# Altium schematic sheet 01-Revision_History_and_Contents.SchDoc: Revision History and Table of Contents
size A; Revision: A; SheetNumber: 1; SheetTotal: 4; ECE315_Project_Name: S25 Brushed DC Motor - Student
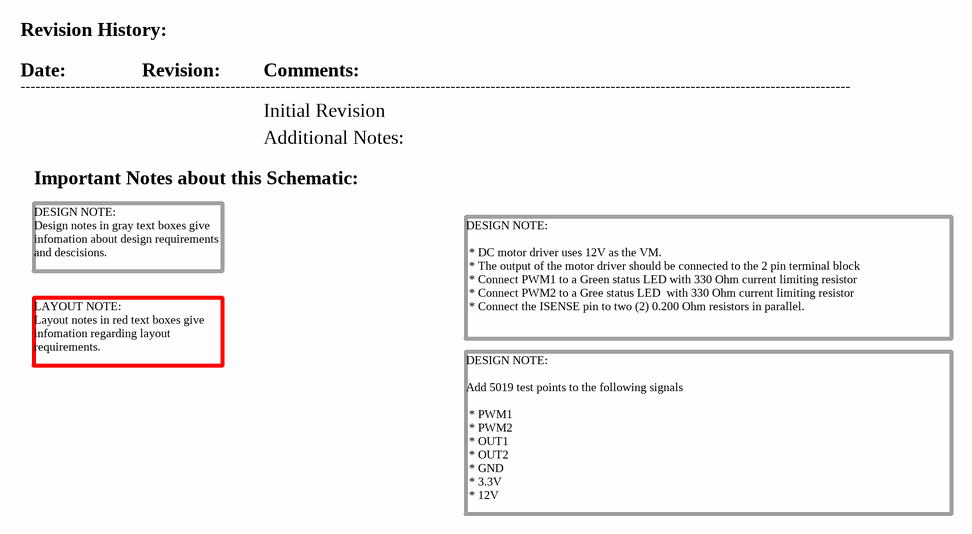
[diagram p0: 01-Revision_History_and_Contents.SchDoc]

## Notes on the sheet
- Revision History:
- Date:
- ----------------------------------------------------------------------------------------------------------------------------------------------------------------------
- Revision:
- Comments:
- Initial Revision
- Important Notes about this Schematic:
- Additional Notes:
- DESIGN NOTE:
  Design notes in gray text boxes give infomation about design requirements and descisions.
- LAYOUT NOTE:
  Layout notes in red text boxes give infomation regarding layout requirements.
- DESIGN NOTE:
  * DC motor driver uses 12V as the VM.
  * The output of the motor driver should be connected to the 2 pin terminal block
  * Connect PWM1 to a Green status LED with 330 Ohm current limiting resistor
  * Connect PWM2 to a Gree status LED  with 330 Ohm current limiting resistor
  * Connect the ISENSE pin to two (2) 0.200 Ohm resistors in parallel.
- DESIGN NOTE:
  Add 5019 test points to the following signals
  * PWM1
  * PWM2
  * OUT1
  * OUT2
  * GND
  * 3.3V
  * 12V
- Title:
- Size:
- A
- Project
- Rev:
- Sheet:
- of
- College of Engineering
- 1415 Engineering Drive
- Madison, WI 53706